# EAGLE schematic 7G_controller (EAGLE 6.4)
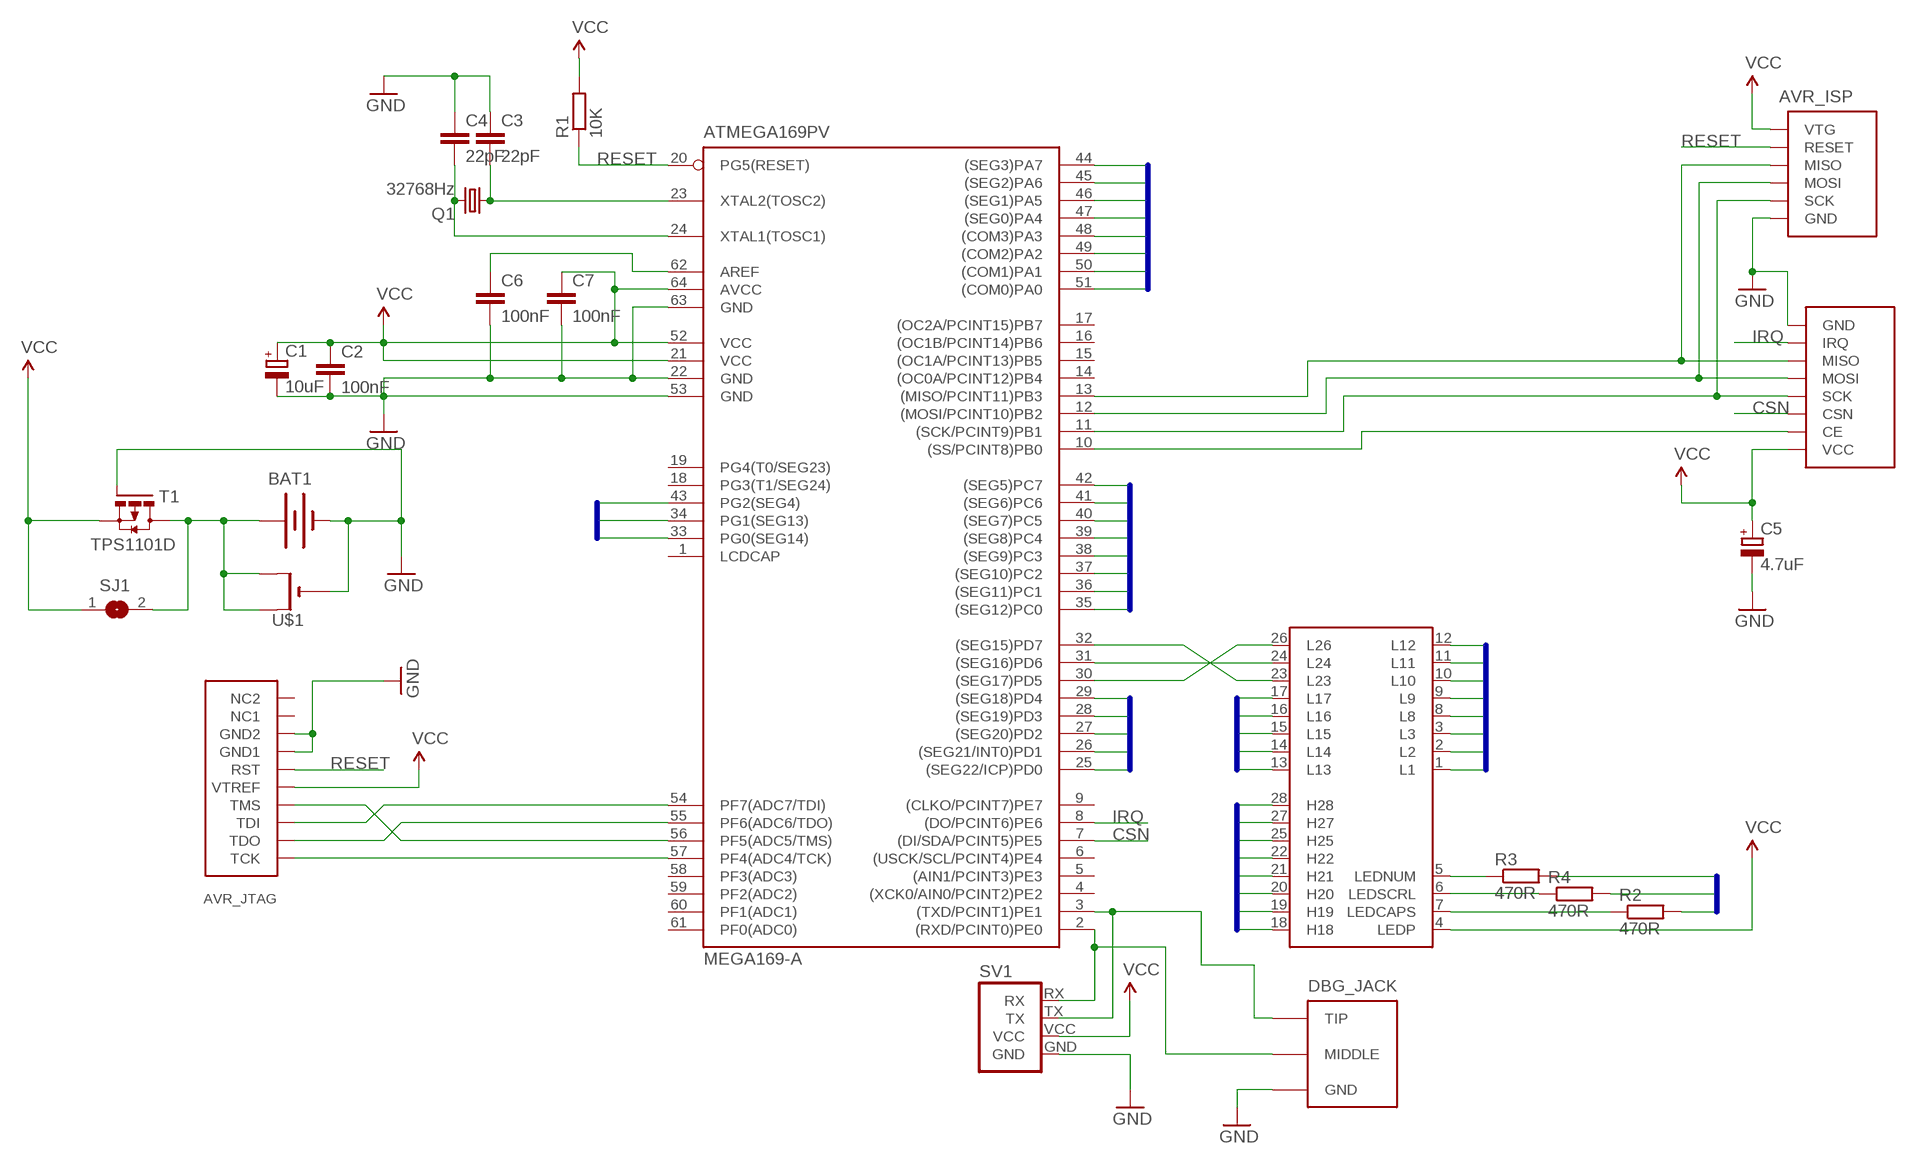
[diagram p0: schematic, sheet 1]

## Parts
ATMEGA169PV  MEGA169-A  [TQFP64]
AVR_ISP  AVR-ISP-6SMALL_FP  [AVR-ISP-6-SMALL-FP]
AVR_JTAG  AVR-JTAG  [AVR-JTAG]
BAT1  BATTERYPLAIN  [BATTERY]
C1  10uF  CPOL-EUSMCB  [SMC_B]
C2  100nF  C-EUC0805  [C0805]
C3  22pF  C-EUC0805  [C0805]
C4  22pF  C-EUC0805  [C0805]
C5  4.7uF  CPOL-EUSMCB  [SMC_B]
C6  100nF  C-EUC0805  [C0805]
C7  100nF  C-EUC0805  [C0805]
DBG_JACK  JACK_FEMALE_3.5MMCHEAP  [JACK_CHEAP]
MTRX_CONN  SS7G_CONNSMD  [SS7G_CONN_SMD]
NRF24L01  NRF24L01_MOD_NINE_EAGLESGENERIC  [NRF24L01_MOD_GENERIC]
Q1  32768Hz  CRYSTAL  [NSK_QUARTZ_CLOCK]
R1  10K  R-EU_R0805  [R0805]
R2  470R  R-EU_R0805  [R0805]
R3  470R  R-EU_R0805  [R0805]
R4  470R  R-EU_R0805  [R0805]
SJ1  SJ  [SJ]
SV1  UART_PORT  [UART_PORT]
T1  TPS1101D  [SO8]
U$1  CR2032SMT  [CR2032-SMD]

## Nets
AREF: ATMEGA169PV.62(AREF) C6.1
CAPS: ATMEGA169PV.43(PG2(SEG4)) R2.2
CE: ATMEGA169PV.10((SS/PCINT8)PB0) NRF24L01.CE
CSN: ATMEGA169PV.7((DI/SDA/PCINT5)PE5) NRF24L01.CSN
GND: ATMEGA169PV.22(GND) ATMEGA169PV.53(GND) ATMEGA169PV.63(GND) AVR_ISP.GND AVR_JTAG.P$2(GND1) AVR_JTAG.P$10(GND2) BAT1.- C1.- C2.2 C3.1 C4.1 C5.- C6.2 C7.2 DBG_JACK.1(GND) NRF24L01.GND SV1.GND T1.4(G) U$1.-
H18: ATMEGA169PV.42((SEG5)PC7) MTRX_CONN.18(H18)
H19: ATMEGA169PV.41((SEG6)PC6) MTRX_CONN.19(H19)
H20: ATMEGA169PV.40((SEG7)PC5) MTRX_CONN.20(H20)
H21: ATMEGA169PV.38((SEG9)PC3) MTRX_CONN.21(H21)
H22: ATMEGA169PV.36((SEG11)PC1) MTRX_CONN.22(H22)
H25: ATMEGA169PV.35((SEG12)PC0) MTRX_CONN.25(H25)
H27: ATMEGA169PV.37((SEG10)PC2) MTRX_CONN.27(H27)
H28: ATMEGA169PV.39((SEG8)PC4) MTRX_CONN.28(H28)
IRQ: ATMEGA169PV.8((DO/PCINT6)PE6) NRF24L01.IRQ
L1: ATMEGA169PV.50((COM1)PA1) MTRX_CONN.1(L1)
L2: ATMEGA169PV.48((COM3)PA3) MTRX_CONN.2(L2)
L3: ATMEGA169PV.46((SEG1)PA5) MTRX_CONN.3(L3)
L8: ATMEGA169PV.45((SEG2)PA6) MTRX_CONN.8(L8)
L9: ATMEGA169PV.44((SEG3)PA7) MTRX_CONN.9(L9)
L10: ATMEGA169PV.25((SEG22/ICP)PD0) MTRX_CONN.10(L10)
L11: ATMEGA169PV.26((SEG21/INT0)PD1) MTRX_CONN.11(L11)
L12: ATMEGA169PV.27((SEG20)PD2) MTRX_CONN.12(L12)
L13: ATMEGA169PV.28((SEG19)PD3) MTRX_CONN.13(L13)
L14: ATMEGA169PV.29((SEG18)PD4) MTRX_CONN.14(L14)
L15: ATMEGA169PV.51((COM0)PA0) MTRX_CONN.15(L15)
L16: ATMEGA169PV.49((COM2)PA2) MTRX_CONN.16(L16)
L17: ATMEGA169PV.47((SEG0)PA4) MTRX_CONN.17(L17)
LEDCAPS: MTRX_CONN.7(LEDCAPS) R2.1
LEDNUM: MTRX_CONN.6(LEDSCRL) R4.1
LEDSCRL: MTRX_CONN.5(LEDNUM) R3.1
MISO: ATMEGA169PV.13((MISO/PCINT11)PB3) AVR_ISP.MISO NRF24L01.MISO
MOSI: ATMEGA169PV.12((MOSI/PCINT10)PB2) AVR_ISP.MOSI NRF24L01.MOSI
N$2: ATMEGA169PV.32((SEG15)PD7) MTRX_CONN.23(L23)
N$4: BAT1.+ SJ1.2 T1.5(D) T1.6(D) T1.7(D) T1.8(D) U$1.+$1(+) U$1.+$2(+1)
N$6: ATMEGA169PV.23(XTAL2(TOSC2)) C3.2 Q1.1
N$8: ATMEGA169PV.24(XTAL1(TOSC1)) C4.2 Q1.4
N$20: ATMEGA169PV.30((SEG17)PD5) MTRX_CONN.26(L26)
N$21: ATMEGA169PV.31((SEG16)PD6) MTRX_CONN.24(L24)
N$29: ATMEGA169PV.2((RXD/PCINT0)PE0) DBG_JACK.4(MIDDLE) SV1.RX
N$30: ATMEGA169PV.3((TXD/PCINT1)PE1) DBG_JACK.2(TIP) DBG_JACK.3(TIP) SV1.TX
NUML: ATMEGA169PV.33(PG0(SEG14)) R3.2
RESET: ATMEGA169PV.20(PG5(RESET)) AVR_ISP.RESET AVR_JTAG.P$6(RST) R1.1
SCK: ATMEGA169PV.11((SCK/PCINT9)PB1) AVR_ISP.SCK NRF24L01.SCK
SCRL: ATMEGA169PV.34(PG1(SEG13)) R4.2
TCK: ATMEGA169PV.57(PF4(ADC4/TCK)) AVR_JTAG.P$1(TCK)
TDI: ATMEGA169PV.54(PF7(ADC7/TDI)) AVR_JTAG.P$9(TDI)
TDO: ATMEGA169PV.55(PF6(ADC6/TDO)) AVR_JTAG.P$3(TDO)
TMS: ATMEGA169PV.56(PF5(ADC5/TMS)) AVR_JTAG.P$5(TMS)
VCC: ATMEGA169PV.21(VCC) ATMEGA169PV.52(VCC) ATMEGA169PV.64(AVCC) AVR_ISP.VCC(VTG) AVR_JTAG.P$4(VTREF) C1.+ C2.1 C5.+ C7.1 MTRX_CONN.4(LEDP) NRF24L01.+3.3V(VCC) R1.2 SJ1.1 SV1.VCC T1.1(S) T1.2(S) T1.3(S)
Unconnected: ATMEGA169PV.1(LCDCAP) ATMEGA169PV.4((XCK0/AIN0/PCINT2)PE2) ATMEGA169PV.5((AIN1/PCINT3)PE3) ATMEGA169PV.6((USCK/SCL/PCINT4)PE4) ATMEGA169PV.9((CLKO/PCINT7)PE7) ATMEGA169PV.14((OC0A/PCINT12)PB4) ATMEGA169PV.15((OC1A/PCINT13)PB5) ATMEGA169PV.16((OC1B/PCINT14)PB6) ATMEGA169PV.17((OC2A/PCINT15)PB7) ATMEGA169PV.18(PG3(T1/SEG24)) ATMEGA169PV.19(PG4(T0/SEG23)) ATMEGA169PV.58(PF3(ADC3)) ATMEGA169PV.59(PF2(ADC2)) ATMEGA169PV.60(PF1(ADC1)) ATMEGA169PV.61(PF0(ADC0)) AVR_JTAG.P$7(NC1) AVR_JTAG.P$8(NC2)

## Buses
H28,H27,H25,H22,H21,H20,H19,H18
L1,L2,L3,L8,L9,L10,L11,L12,L13,L14,L15,L16,L17,L23,L24,L26
NUML,SCRL,CAPS

## Library data of the parts
ATMEGA169PV = KileParts:MEGA169: MICROCONTROLLER 16 Kbytes FLASH 1 Kbytes SRAM 512 bytes EEPROM USART 8-channel 10 bit ADC 4x25 Segment LCD Driver Source: avr.lbr; MPN: ATMEGA169PV-8AU; OC_FARNELL: 1617046; OC_NEWARK: 03P4011
AVR_ISP = KileParts:AVR-ISP-6: AVR ISP-6 Serial Programming Header
AVR_JTAG = KileParts:AVR-JTAG
BAT1 = KileParts:BATTERY: Battery Holders Various common sizes : AA, AAA, 20mm coin cell and 12mm coin cell.
C1 C5 = rcl:CPOL-EU: POLARIZED CAPACITOR, European symbol
C2-C4 C6 C7 = rcl:C-EU: CAPACITOR, European symbol
DBG_JACK = KileParts:JACK_FEMALE_3.5MM
MTRX_CONN = KileParts:SS7G_CONN: Connector for Steelseries 7G keyboard controller.
NRF24L01 = KileParts:NRF24L01_MOD_NINE_EAGLES
Q1 = KileParts:CRYSTAL: CRYSTAL
R1-R4 = rcl:R-EU_: RESISTOR, European symbol
SJ1 = jumper:SJ: SMD solder JUMPER
SV1 = KileParts:UART_PORT: PIN HEADER; OC_FARNELL: unknown; OC_NEWARK: unknown
T1 = KileParts:TPS1101D
U$1 = adafruit:CR2032